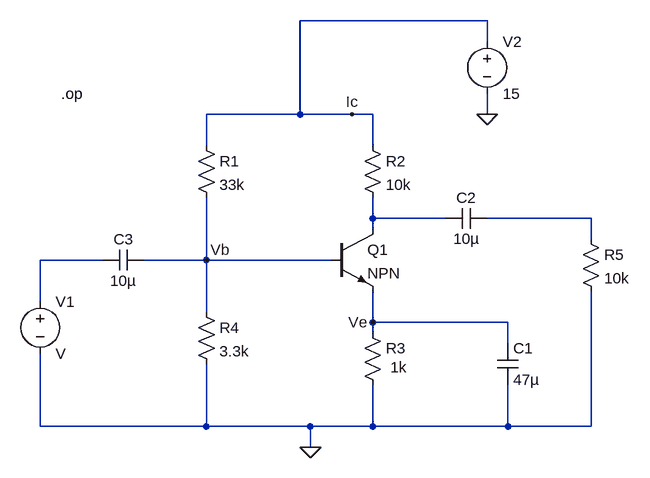
[diagram p0: schematic Ex-8.asc]
Ex-8.asc, the LTspice schematic file:
Version 4
SHEET 1 880 680
WIRE 416 -224 128 -224
WIRE 416 -192 416 -224
WIRE 128 -80 128 -224
WIRE 128 -80 -16 -80
WIRE 208 -80 128 -80
WIRE 240 -80 208 -80
WIRE 416 -80 416 -112
WIRE -16 -32 -16 -80
WIRE 240 -32 240 -80
WIRE 240 80 240 48
WIRE 352 80 240 80
WIRE 576 80 416 80
WIRE 240 96 240 80
WIRE 576 112 576 80
WIRE -176 144 -272 144
WIRE -16 144 -16 48
WIRE -16 144 -112 144
WIRE 176 144 -16 144
WIRE -272 208 -272 144
WIRE -16 224 -16 144
WIRE 240 240 240 192
WIRE 448 240 240 240
WIRE 240 256 240 240
WIRE 448 272 448 240
WIRE -272 400 -272 288
WIRE -16 400 -16 304
WIRE -16 400 -272 400
WIRE 144 400 -16 400
WIRE 240 400 240 336
WIRE 240 400 144 400
WIRE 448 400 448 336
WIRE 448 400 240 400
WIRE 576 400 576 192
WIRE 576 400 448 400
WIRE 144 432 144 400
FLAG 144 432 0
FLAG 240 240 Ve
FLAG -16 144 Vb
FLAG 416 -80 0
FLAG 208 -80 Ic
DATAFLAG 176 240 ""
DATAFLAG 240 64 ""
SYMBOL res -32 -48 R0
SYMATTR InstName R1
SYMATTR Value 33k
SYMBOL res 224 -48 R0
SYMATTR InstName R2
SYMATTR Value 10k
SYMBOL res 224 240 R0
WINDOW 3 43 69 Left 2
SYMATTR InstName R3
SYMATTR Value 1k
SYMBOL cap 432 272 R0
SYMATTR InstName C1
SYMATTR Value 47µ
SYMBOL voltage -272 192 R0
SYMATTR InstName V1
SYMBOL voltage 416 -208 R0
WINDOW 123 0 0 Left 0
WINDOW 39 0 0 Left 0
SYMATTR InstName V2
SYMATTR Value 15
SYMBOL res -32 208 R0
SYMATTR InstName R4
SYMATTR Value 3.3k
SYMBOL cap 416 64 R90
WINDOW 0 0 32 VBottom 2
WINDOW 3 32 32 VTop 2
SYMATTR InstName C2
SYMATTR Value 10µ
SYMBOL res 560 96 R0
SYMATTR InstName R5
SYMATTR Value 10k
SYMBOL cap -112 128 R90
WINDOW 0 0 32 VBottom 2
WINDOW 3 32 32 VTop 2
SYMATTR InstName C3
SYMATTR Value 10µ
SYMBOL npn 176 96 R0
SYMATTR InstName Q1
TEXT -240 -112 Left 2 !.op

The netlist it stands for:
* Ex-8.asc
R1 Ic Vb 33k
R2 Ic N001 10k
R3 Ve 0 1k
C1 Ve 0 47µ
V1 N003 0 V
V2 Ic 0 15
R4 Vb 0 3.3k
C2 N002 N001 10µ
R5 N002 0 10k
C3 Vb N003 10µ
Q1 N001 Vb Ve 0 NPN
.model NPN NPN
.model PNP PNP
.lib standard.bjt
.op
.backanno
.end